# EAGLE design piquino (EAGLE 5.12)
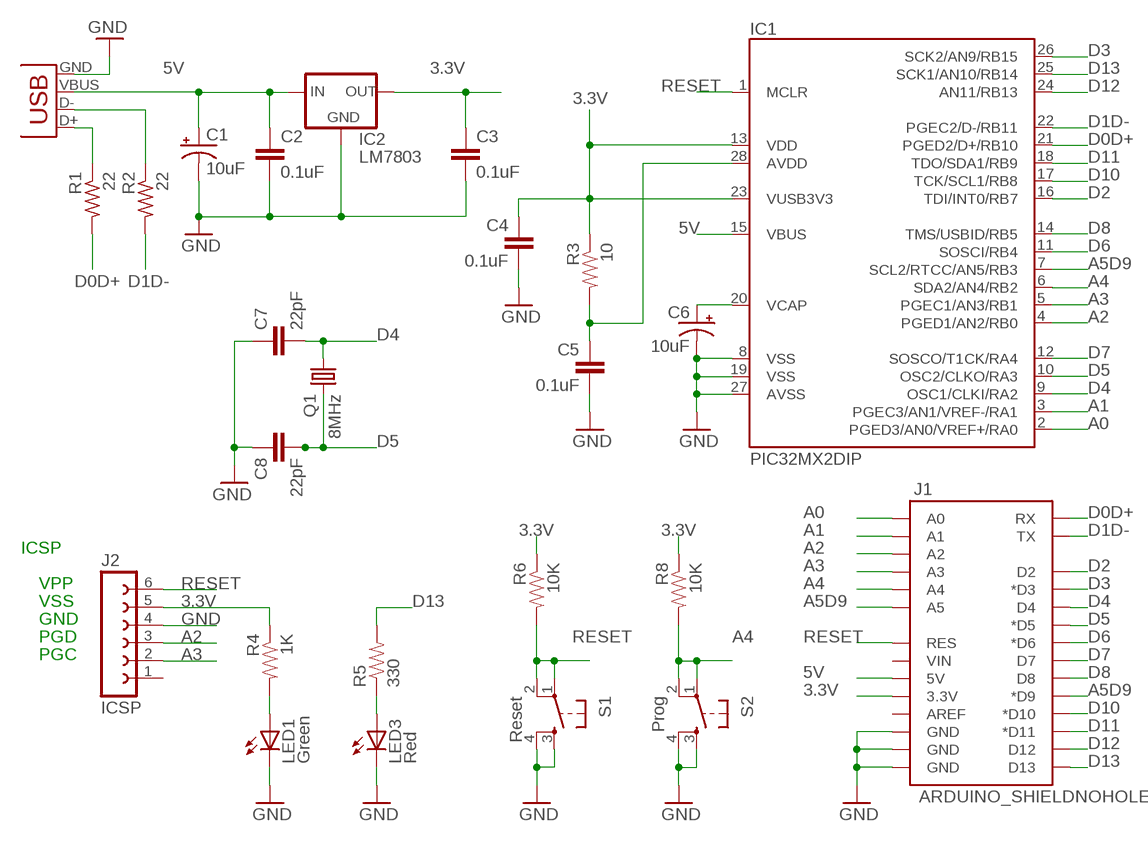
[diagram p0: schematic, sheet 1]

## Parts
C1  10uF  CAP_POLPTH2  [CPOL-RADIAL-10UF-25V]
C2  0.1uF  CAPPTH  [CAP-PTH-SMALL]
C3  0.1uF  CAPPTH1  [CAP-PTH-5MM]
C4  0.1uF  CAPPTH1  [CAP-PTH-5MM]
C5  0.1uF  CAPPTH1  [CAP-PTH-5MM]
C6  10uF  CAP_POLPTH2  [CPOL-RADIAL-10UF-25V]
C7  22pF  CAPPTH  [CAP-PTH-SMALL]
C8  22pF  CAPPTH  [CAP-PTH-SMALL]
IC1  PIC32MX2DIP  [DIL28-3]
IC2  LM7803  V_REG_78XXSIDE  [78XXL]
J1  ARDUINO_SHIELDNOHOLES  [DUEMILANOVE_SHIELD_NOHOLES]
J2  ICSP  FE06-1  [FE06]
LED1  Green  LED3MM  [LED3MM]
LED3  Red  LED3MM  [LED3MM]
Q1  8MHz  CRYSTALHC49US  [HC49US]
R1  22  R-US_0207/15  [0207/15]
R2  22  R-US_0207/15  [0207/15]
R3  10  RESISTORPTH1  [AXIAL-0.3]
R4  1K  RESISTORPTH1  [AXIAL-0.3]
R5  330  RESISTORPTH1  [AXIAL-0.3]
R6  10K  RESISTORPTH1  [AXIAL-0.3]
R8  10K  RESISTORPTH1  [AXIAL-0.3]
S1  Reset  TAC_SWITCHPTH  [TACTILE-PTH]
S2  Prog  TAC_SWITCHPTH  [TACTILE-PTH]
X1  USBPTH  [USB-B-PTH]

## Nets
3.3V: C3.1 C4.1 IC1.13(VDD) IC1.23(VUSB3V3) IC2.OUT J1.3.3V J2.5 R3.P$1 R4.P$1 R6.P$1 R8.P$1
5V: C1.1(+) C2.1 IC1.15(VBUS) IC2.IN J1.5V X1.VBUS
A0: IC1.2(PGED3/AN0/VREF+/RA0) J1.A0
A1: IC1.3(PGEC3/AN1/VREF-/RA1) J1.A1
A2: IC1.4(PGED1/AN2/RB0) J1.A2 J2.3
A3: IC1.5(PGEC1/AN3/RB1) J1.A3 J2.2
A4: IC1.6(SDA2/AN4/RB2) J1.A4 R8.P$2 S2.1 S2.2
A5D9: IC1.7(SCL2/RTCC/AN5/RB3) J1.A5 J1.D9(*D9)
AVDD: C5.1 IC1.28(AVDD) R3.P$2
D0D+: IC1.21(PGED2/D+/RB10) J1.RX R1.2
D1D-: IC1.22(PGEC2/D-/RB11) J1.TX R2.2
D2: IC1.16(TDI/INT0/RB7) J1.D2
D3: IC1.26(SCK2/AN9/RB15) J1.D3(*D3)
D4: C7.2 IC1.9(OSC1/CLKI/RA2) J1.D4 Q1.1
D5: C8.2 IC1.10(OSC2/CLKO/RA3) J1.D5(*D5) Q1.2
D6: IC1.11(SOSCI/RB4) J1.D6(*D6)
D7: IC1.12(SOSCO/T1CK/RA4) J1.D7
D8: IC1.14(TMS/USBID/RB5) J1.D8
D10: IC1.17(TCK/SCL1/RB8) J1.D10(*D10)
D11: IC1.18(TDO/SDA1/RB9) J1.D11(*D11)
D12: IC1.24(AN11/RB13) J1.D12
D13: IC1.25(SCK1/AN10/RB14) J1.D13 R5.P$2
GND: C1.2(-) C2.2 C3.2 C4.2 C5.2 C6.2(-) C7.1 C8.1 IC1.8(VSS) IC1.19(VSS) IC1.27(AVSS) IC2.GND J1.GND@0(GND) J1.GND@1(GND) J1.GND@2(GND) J2.4 LED1.K(C) LED3.K(C) S1.3 S1.4 S2.3 S2.4 X1.GND
J3: R2.1 X1.D-
N$2: LED1.A R4.P$2
N$6: R1.1 X1.D+
N$10: LED3.A R5.P$1
RESET: IC1.1(MCLR) J1.RES J2.6 R6.P$2 S1.1 S1.2
VCAP: C6.1(+) IC1.20(VCAP)
Unconnected: J1.AREF J1.VIN J2.1

## Notes on the sheet
- ICSP
- VPP
- VSS
- GND
- PGD
- PGC

## Library data of the parts
C1 C6 = SparkFun:CAP_POL: Capacitor Polarized These are standard SMD and PTH capacitors. Normally 10uF, 47uF, and 100uF in electrolytic and tantalum varieties. Always verify the external diameter of the through hole cap, it varies with capacity, voltage, and manufacturer. The EIA devices should be standard.
C2-C5 C7 C8 = SparkFun:CAP: Capacitor Standard 0603 ceramic capacitor, and 0.1" leaded capacitor.
IC1 = Vak:PIC32MX2
IC2 = SparkFun:V_REG_78XX: Voltage Regulator Standard 7805 5V regulator. IGO (Input Ground Output). Spark Fun Electronics SKU : COM-00107
J1 = SparkFun:ARDUINO_SHIELD
J2 = con-lsta:FE06-1: FEMALE HEADER
LED1 LED3 = SparkFun:LED: LEDs Standard schematic elements and footprints for 5mm, 3mm, 1206, and 0603 sized LEDs. 5mm - Spark Fun Electronics SKU : COM-00529 (and others)
Q1 = SparkFun:CRYSTAL: Crystals Various standard crystals. Proven footprints. Spark Fun Electronics SKU : COM-00534
R1 R2 = rcl:R-US_: RESISTOR, American symbol
R3-R6 R8 = SparkFun:RESISTOR: Resistor Basic schematic elements and footprints for 0603, 1206, and PTH 1/10th watt (small) resistors.
S1 S2 = SparkFun:TAC_SWITCH: Momentary Switch Button commonly used for reset or general input. Spark Fun Electronics SKU : COM-00097
X1 = SparkFun:USB: USB Connectors USB-B-PTH is fully proven SKU : PRT-00139 USB-miniB is fully proven SKU : PRT-00587 USB-A-PCB is untested. USB-A-H is throughly reviewed, but untested. Spark Fun Electronics SKU : PRT-00437 USB-B-SMT is throughly reviewed, but untested. Needs silkscreen touching up. USB-A-S has not been used/tested USB-MB-H has not been used/tested

## Board
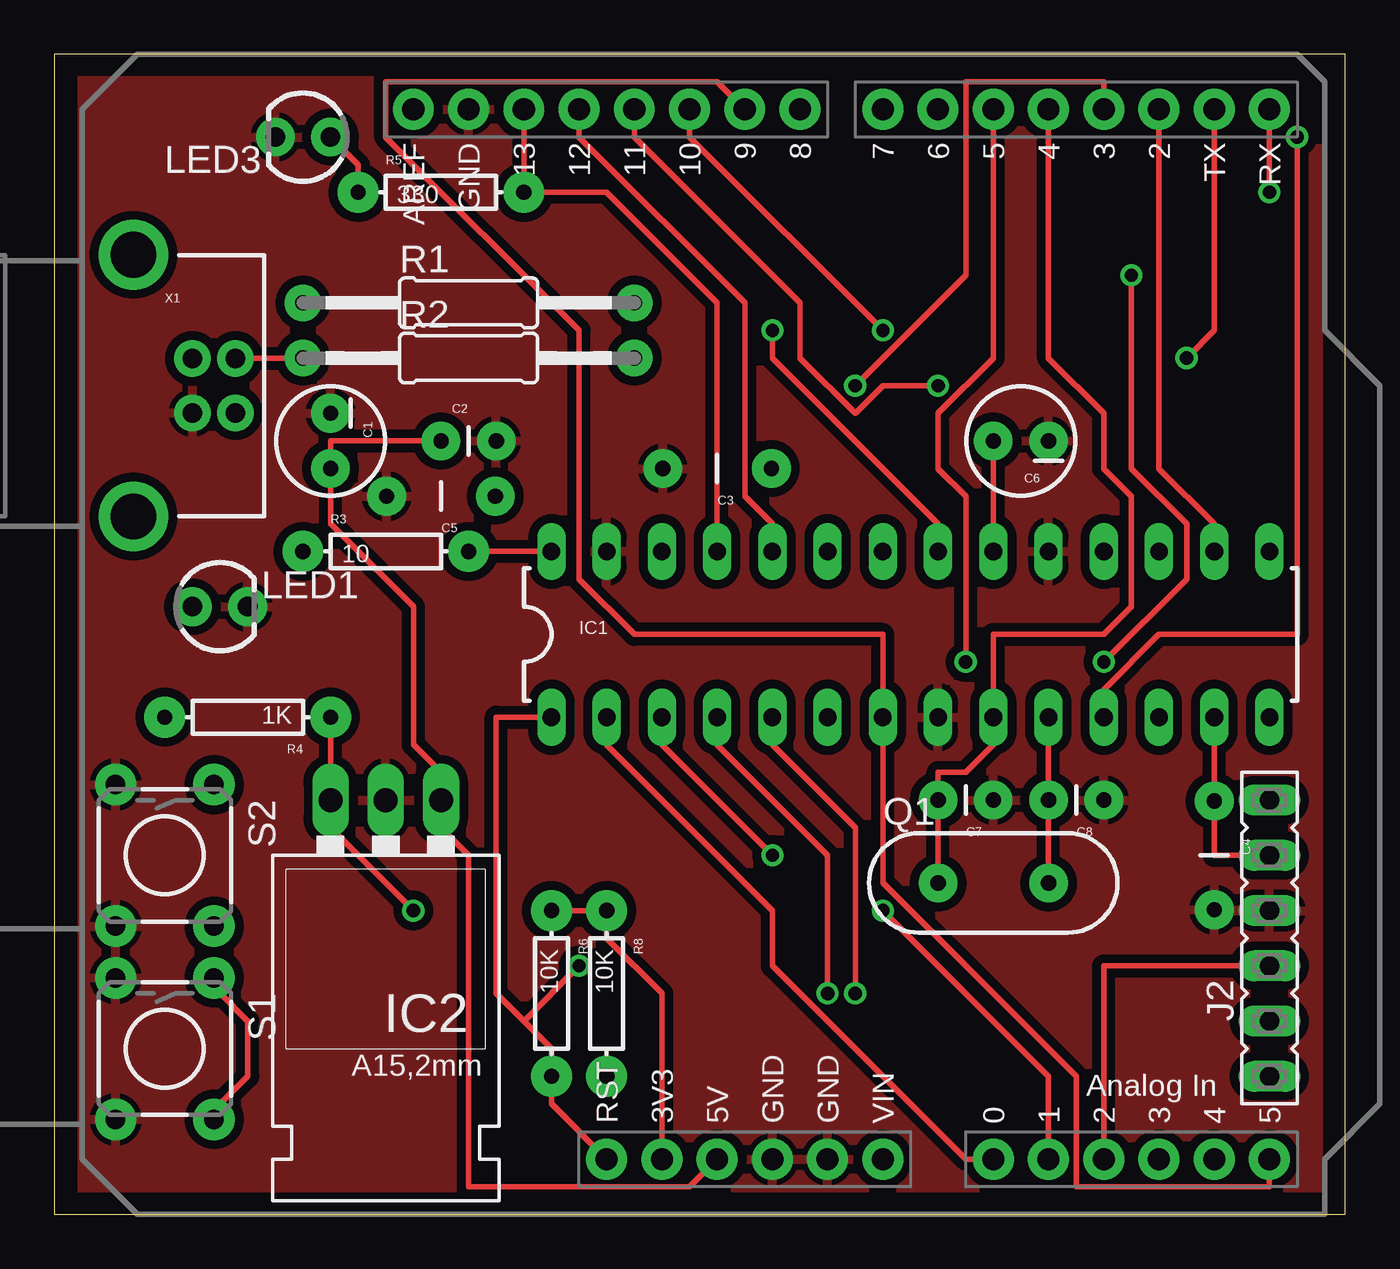
[diagram p1: board, top side]
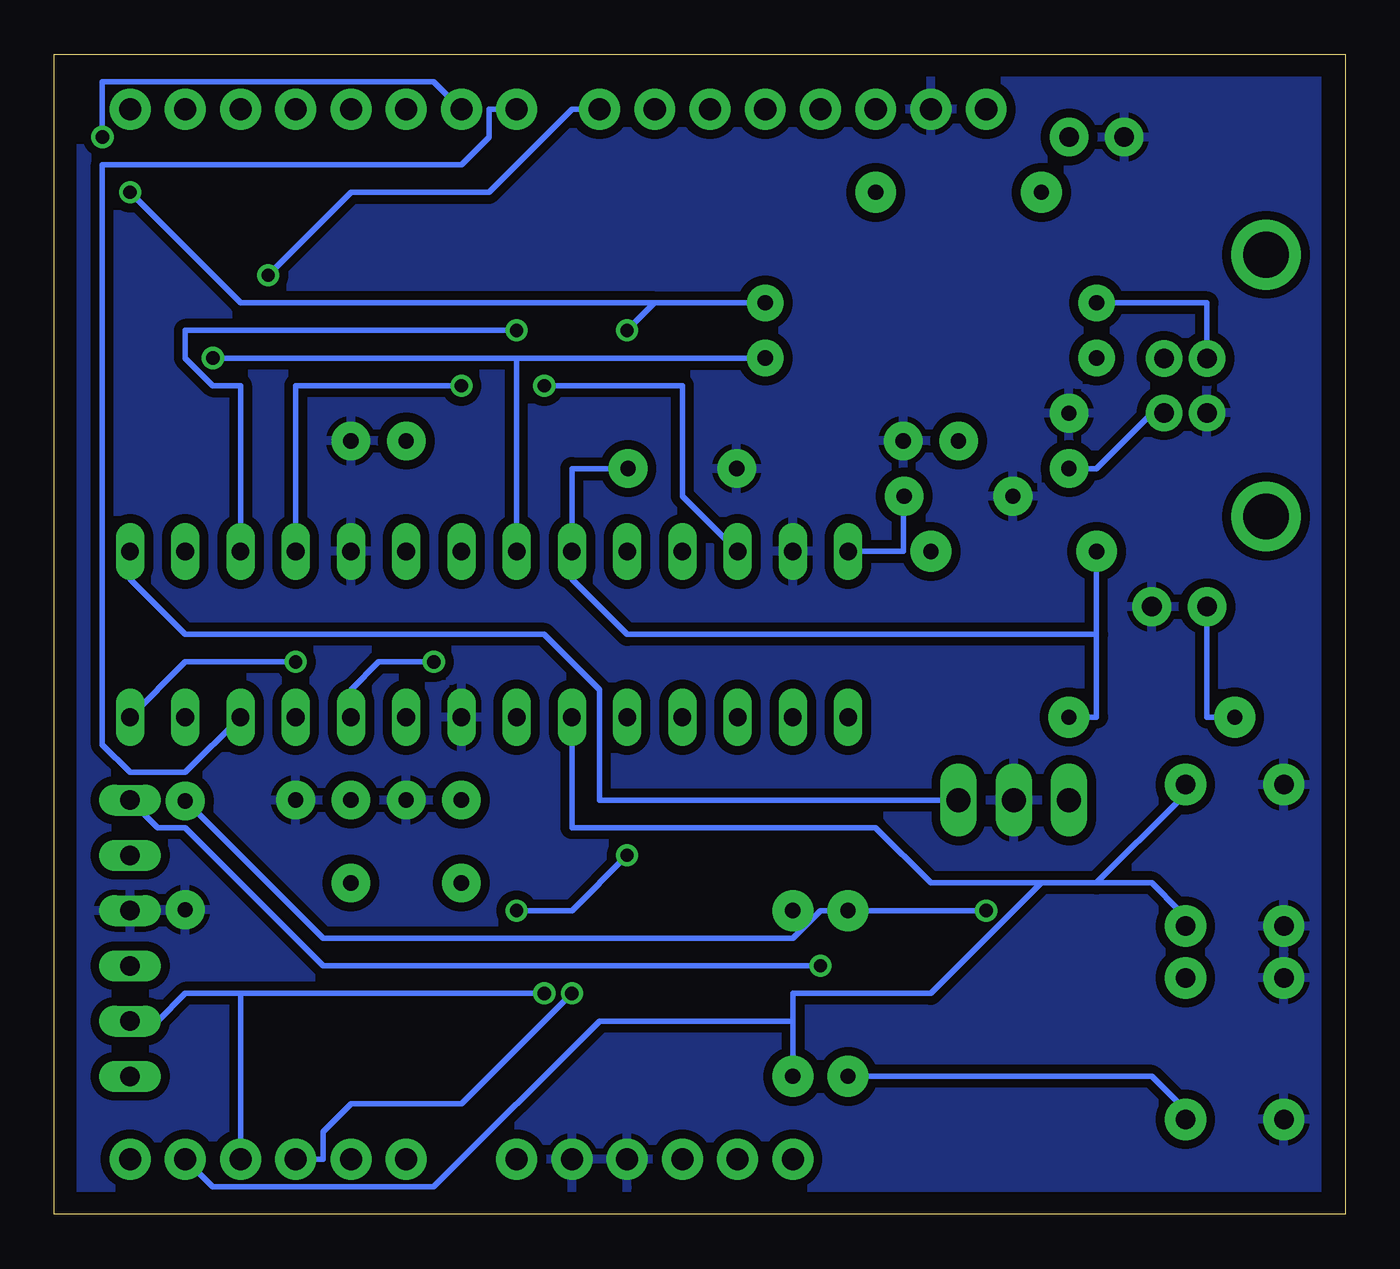
[diagram p2: board, bottom side, seen from below]

Size 59.36 x 53.33 mm. Coordinates in mm from the lower left corner, seen from the top.
Outline: 0,0 59.36,0 59.36,53.33 0,53.33 0,0
Copper layers (1*16): Top 0.035mm / dielectric 1.5mm / Bottom 0.035mm
Design rules "default": minimum track width 10mil, minimum drill 24mil, track to track 8mil, track to pad 8mil, pad to pad 8mil, via to via 8mil, smd to smd 8mil, copper to edge 40mil, drill to drill 8mil, minimum pad ring 10mil, minimum via ring 8mil, stop-mask expansion 4mil, vias tented up to drill 0mil, thermal gap 10mil

### Footprints (pad centres in the part's own frame; a part is rotated, then mirrored left to right if it is on the bottom)
CPOL-RADIAL-10UF-25V = drill 0.7 pad 1.778 round: 1 1.27,0; 2 -1.27,0
CAP-PTH-SMALL = drill 0.7 pad 1.778 round: 1 0,0; 2 2.54,0
CAP-PTH-5MM = drill 0.7 pad 1.778 round: 1 -2.5,0; 2 2.5,0
DIL28-3 = drill 0.813 long: 1 -16.51,-3.81; 2 -13.97,-3.81; 3 -11.43,-3.81; 4 -8.89,-3.81; 5 -6.35,-3.81; 6 -3.81,-3.81; 7 -1.27,-3.81; 8 1.27,-3.81; 9 3.81,-3.81; 10 6.35,-3.81; 11 8.89,-3.81; 12 11.43,-3.81; 13 13.97,-3.81; 14 16.51,-3.81; 15 16.51,3.81; 16 13.97,3.81; 17 11.43,3.81; 18 8.89,3.81; 19 6.35,3.81; 20 3.81,3.81; 21 1.27,3.81; 22 -1.27,3.81; 23 -3.81,3.81; 24 -6.35,3.81; 25 -8.89,3.81; 26 -11.43,3.81; 27 -13.97,3.81; 28 -16.51,3.81
78XXL = drill 1.1 pad 1.676 long: GND 0,-3.81; IN -2.54,-3.81; OUT 2.54,-3.81
DUEMILANOVE_SHIELD_NOHOLES = drill 1.016 pad 1.88 round: 3.3V 50.8,26.67; 5V 50.8,29.21; A0 50.8,41.91; A1 50.8,44.45; A2 50.8,46.99; A3 50.8,49.53; A4 50.8,52.07; A5 50.8,54.61; AREF 2.54,15.24; D2 2.54,49.53; D3 2.54,46.99; D4 2.54,44.45; D5 2.54,41.91; D6 2.54,39.37; D7 2.54,36.83; D8 2.54,33.02; D9 2.54,30.48; D10 2.54,27.94; D11 2.54,25.4; D12 2.54,22.86; D13 2.54,20.32; GND@0 50.8,31.75; GND@1 50.8,34.29; GND@2 2.54,17.78; RES 50.8,24.13; RX 2.54,54.61; TX 2.54,52.07; VIN 50.8,36.83
FE06 = drill 0.9 pad 1.422 long: 1 -6.35,0; 2 -3.81,0; 3 -1.27,0; 4 1.27,0; 5 3.81,0; 6 6.35,0
LED3MM = drill 0.9 pad 1.778 round: A -1.27,0; K 1.27,0
HC49US = drill 0.7 pad 1.778 round: 1 -2.54,0; 2 2.54,0
0207/15 = drill 0.7 pad 1.676 round: 1 -7.62,0; 2 7.62,0
AXIAL-0.3 = drill 0.7 pad 1.88 round: P$1 -3.81,0; P$2 3.81,0
TACTILE-PTH = drill 0.9 pad 1.9 round: 1 -3.251,2.261; 2 3.251,2.261; 3 -3.251,-2.261; 4 3.251,-2.261
USB-B-PTH = drill 0.9 pad 1.676 round: D+ 0,1.25; D- 1.981,1.25; GND 0,-1.25; VBUS 1.981,-1.25 | drill 2.1 pad 3.2 round: P$1 -2.718,-6.02; P$2 -2.718,6.02

### Placement (x,y rotation side)
C1  12.7,35.56 270 top
C2  17.78,35.56 0 top
C3  30.48,34.29 180 top
C4  53.34,16.51 270 top
C5  17.78,33.02 180 top
C6  44.45,35.56 180 top
C7  43.18,19.05 180 top
C8  48.26,19.05 180 top
IC1  39.37,26.67 0 top
IC2  15.24,15.24 180 top
J1  1.27,53.34 270 top
J2  55.88,12.7 90 top
LED1  7.62,27.94 0 top
LED3  11.43,49.53 180 top
Q1  43.18,15.24 0 top
R1  19.05,41.91 0 top
R2  19.05,39.37 0 top
R3  15.24,30.48 0 top
R4  8.89,22.86 180 top
R5  17.78,46.99 0 top
R6  22.86,10.16 270 top
R8  25.4,10.16 270 top
S1  5.08,7.62 270 top
S2  5.08,16.51 270 top
X1  6.35,38.1 0 top

### Tracks (layer width: path | path; a pad name or v marks a point on that pad's centre or on a via)
3.3V  (via drill 0.61)
  Top 0.254: R4.P$1 IC2.OUT 12.7,17.78 v16.51,13.97 | J2.5 53.34,16.51 C4.1 IC1.13 | R6.P$1 R8.P$1 25.4,12.7 27.94,10.16 J1.3.3V
  Bottom 0.254: C3.1 35.56,34.29 IC1.23 35.56,29.21 33.02,26.67 11.43,26.67 | 11.43,26.67 11.43,22.86 R4.P$1 | 11.43,26.67 R3.P$1 | C4.1 53.34,19.05 46.99,12.7 25.4,12.7 24.13,13.97 R6.P$1 v16.51,13.97
5V
  Top 0.254: C2.1 12.7,35.56 C1.1 12.7,31.75 16.51,27.94 16.51,21.59 17.78,20.32 IC2.IN 17.78,17.78 19.05,16.51 19.05,1.27 29.21,1.27 J1.5V
  Bottom 0.254: C1.1 11.43,34.29 8.89,36.83 X1.VBUS | IC1.15 55.88,29.21 53.34,26.67 36.83,26.67 34.29,24.13 34.29,19.05 IC2.IN
A0
  Top 0.254: IC1.2 25.4,21.59 33.02,13.97 33.02,11.43 41.91,2.54 J1.A0
A1  (via drill 0.61)
  Top 0.254: IC1.3 27.94,21.59 v33.02,16.51 | v38.1,13.97 45.72,6.35 J1.A1
  Bottom 0.254: v33.02,16.51 35.56,13.97 v38.1,13.97
A2  (via drill 0.61)
  Top 0.254: IC1.4 30.48,21.59 35.56,16.51 v35.56,10.16 | J2.3 48.26,11.43 J1.A2
  Bottom 0.254: v35.56,10.16 40.64,5.08 45.72,5.08 46.99,3.81 46.99,2.54 J1.A2
A3  (via drill 0.61)
  Top 0.254: IC1.5 33.02,21.59 36.83,17.78 v36.83,10.16
  Bottom 0.254: 50.8,10.16 53.34,10.16 54.61,8.89 J2.2 | v36.83,10.16 50.8,10.16 | 50.8,10.16 J1.A3
A4
  Bottom 0.254: IC1.6 35.56,17.78 21.59,17.78 19.05,15.24 13.97,15.24 | 11.43,15.24 8.89,15.24 7.62,13.97 S2.2 | 11.43,15.24 13.97,15.24 | 25.4,8.89 25.4,10.16 19.05,10.16 13.97,15.24 | 25.4,8.89 R8.P$2 | J1.A4 52.07,1.27 41.91,1.27 34.29,8.89 25.4,8.89 | 11.43,15.24 7.62,19.05 S2.1
A5D9
  Top 0.254: J1.A5 55.88,1.27 46.99,1.27 46.99,6.35 38.1,15.24 IC1.7 38.1,26.67 26.67,26.67 24.13,29.21 24.13,40.64 15.24,49.53 15.24,52.07 30.48,52.07 J1.D9
AVDD
  Top 0.254: R3.P$2 IC1.28
  Bottom 0.254: IC1.28 20.32,30.48 20.32,33.02 C5.1
D0D+  (via drill 0.61)
  Top 0.254: IC1.21 40.64,31.75 33.02,39.37 v33.02,40.64 | v55.88,46.99 J1.RX
  Bottom 0.254: v33.02,40.64 31.75,41.91 | 31.75,41.91 R1.2 | v55.88,46.99 50.8,41.91 31.75,41.91
D1D-  (via drill 0.61)
  Top 0.254: J1.TX 53.34,40.64 v52.07,39.37
  Bottom 0.254: IC1.22 38.1,39.37 | 38.1,39.37 R2.2 | 38.1,39.37 v52.07,39.37
D2
  Top 0.254: IC1.16 53.34,31.75 50.8,34.29 J1.D2
D3  (via drill 0.61)
  Top 0.254: v36.83,38.1 41.91,43.18 41.91,52.07 48.26,52.07 J1.D3
  Bottom 0.254: IC1.26 30.48,33.02 30.48,38.1 v36.83,38.1
D4
  Top 0.254: Q1.1 C7.2 40.64,20.32 41.91,20.32 43.18,21.59 IC1.9 43.18,26.67 48.26,26.67 49.53,27.94 49.53,33.02 48.26,34.29 48.26,36.83 45.72,39.37 J1.D4
D5  (via drill 0.61)
  Top 0.254: IC1.10 C8.2 Q1.2 | J1.D5 43.18,39.37 40.64,36.83 40.64,34.29 41.91,33.02 v41.91,25.4
  Bottom 0.254: v41.91,25.4 44.45,25.4 45.72,24.13 IC1.10
D6  (via drill 0.61)
  Top 0.254: IC1.11 48.26,24.13 50.8,26.67 57.15,26.67 v57.15,49.53
  Bottom 0.254: v57.15,49.53 57.15,52.07 41.91,52.07 J1.D6
D7
  Bottom 0.254: IC1.12 53.34,20.32 55.88,20.32 57.15,21.59 57.15,48.26 40.64,48.26 39.37,49.53 39.37,50.8 J1.D7
D8  (via drill 0.61)
  Top 0.254: v48.26,25.4 52.07,29.21 52.07,31.75 49.53,34.29 v49.53,43.18
  Bottom 0.254: IC1.14 53.34,25.4 v48.26,25.4 | v49.53,43.18 45.72,46.99 39.37,46.99 35.56,50.8 J1.D8
D10  (via drill 0.61)
  Top 0.254: v38.1,40.64 29.21,49.53 J1.D10
  Bottom 0.254: IC1.17 50.8,38.1 52.07,38.1 53.34,39.37 53.34,40.64 v38.1,40.64
D11  (via drill 0.61)
  Top 0.254: v40.64,38.1 38.1,38.1 36.83,36.83 34.29,39.37 34.29,41.91 26.67,49.53 J1.D11
  Bottom 0.254: IC1.18 48.26,38.1 v40.64,38.1
D12
  Top 0.254: IC1.24 33.02,31.75 31.75,33.02 31.75,41.91 24.13,49.53 J1.D12
D13
  Top 0.254: IC1.25 30.48,41.91 25.4,46.99 R5.P$2 J1.D13
GND
  pour Bottom (isolate 0.406): 1.27,53.34 58.42,53.34 58.42,0 1.27,0
  pour Top (isolate 0.406): 1.27,53.34 59.69,53.34 59.69,0 1.27,0
J3
  Top 0.254: R2.1 8.89,39.37 X1.D-
N$2
  Bottom 0.254: LED1.A 6.35,22.86 R4.P$2
N$6
  Bottom 0.254: R1.1 6.35,41.91 X1.D+
N$10
  Top 0.254: LED3.A 13.97,48.26 R5.P$1
RESET  (via drill 0.61)
  Top 0.254: S1.2 7.62,5.08 8.89,6.35 8.89,8.89 7.62,10.16 S1.1 | IC1.1 20.32,22.86 20.32,10.16 21.59,8.89 | 21.59,8.89 22.86,7.62 R6.P$2 22.86,5.08 J1.RES | 21.59,8.89 v24.13,11.43
  Bottom 0.254: J2.6 54.61,17.78 53.34,17.78 46.99,11.43 v24.13,11.43 | R6.P$2 8.89,6.35 7.62,5.08 S1.2
VCAP
  Top 0.254: IC1.20 C6.1